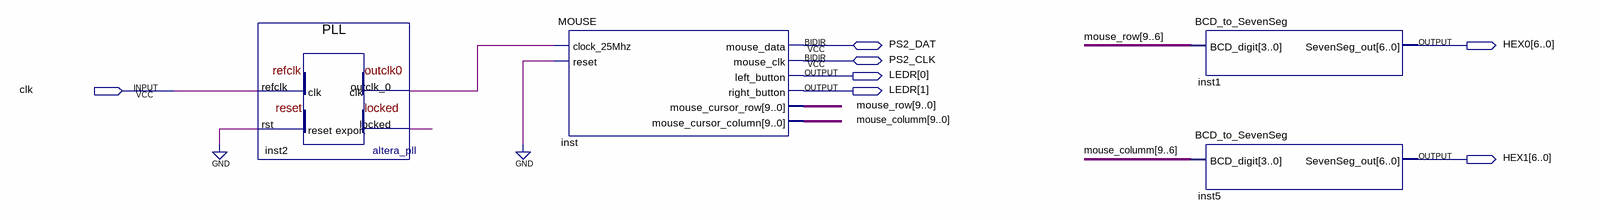
[diagram p0: schematic sheet]
// Quartus schematic 7seg.bdf as structural Verilog: 4 symbols, 7 pins
module \7seg  (
  input  clk,
  inout  PS2_DAT,
  inout  PS2_CLK,
  output [6:0] HEX0,
  output [1:0] LEDR,
  output [6:0] HEX1
);

  wire inst2_locked, inst2_outclk_0;
  wire [9:0] mouse_columm, mouse_row;

  PLL inst2 (.refclk(clk), .rst(1'b0), .outclk_0(inst2_outclk_0), .locked(inst2_locked));
  MOUSE inst (
    .clock_25Mhz(inst2_outclk_0), .reset(1'b0), .left_button(LEDR[0]), .right_button(LEDR[1]),
    .mouse_cursor_row(mouse_row), .mouse_cursor_column(mouse_columm), .mouse_data(PS2_DAT),
    .mouse_clk(PS2_CLK));
  BCD_to_SevenSeg inst1 (.BCD_digit(mouse_row[9:6]), .SevenSeg_out(HEX0));
  BCD_to_SevenSeg inst5 (.BCD_digit(mouse_columm[9:6]), .SevenSeg_out(HEX1));
endmodule
